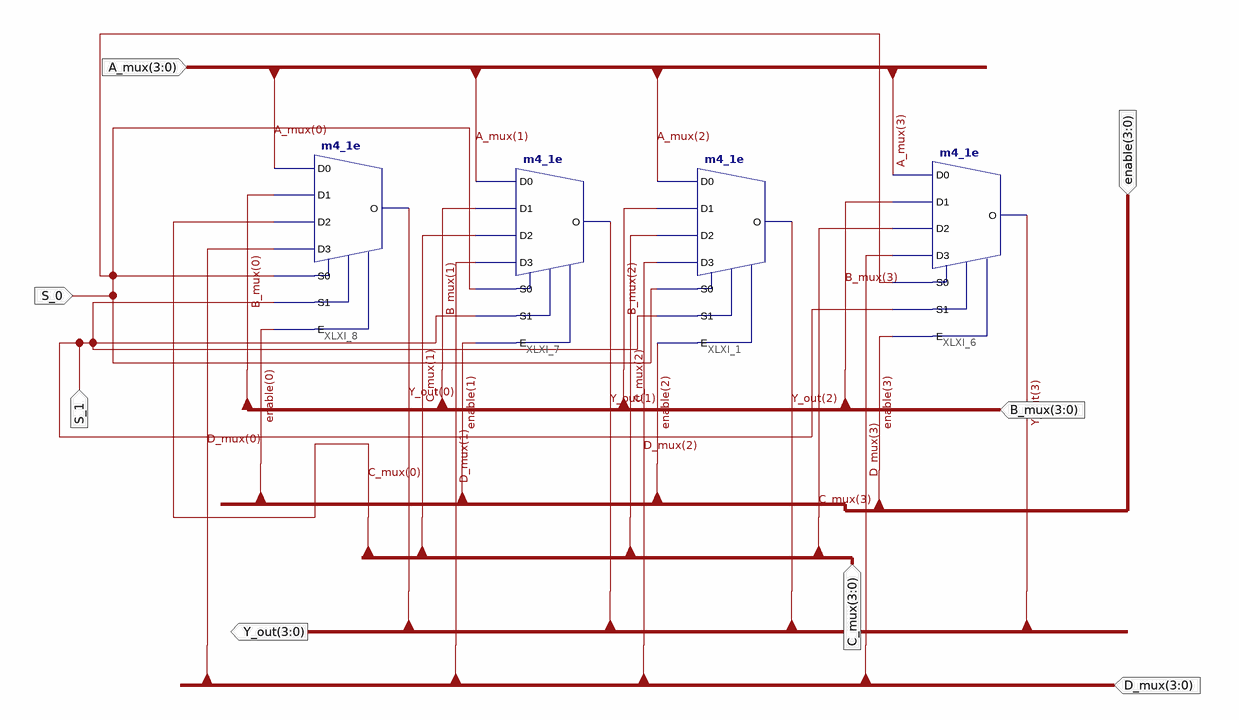
[diagram p0: schematic sheet 1]
// Xilinx ISE schematic mux4to4.sch (spartan6) as structural Verilog: 4 symbols, 8 ports
module mux4to4 (
  input  [3:0] A_mux,
  input  [3:0] B_mux,
  input  [3:0] C_mux,
  input  [3:0] D_mux,
  input  S_0,
  input  S_1,
  input  [3:0] enable,
  output [3:0] Y_out
);

  m4_1e XLXI_1 (
    .D0(A_mux[2]), .D1(B_mux[2]), .D2(C_mux[2]), .D3(D_mux[2]), .E(enable[2]), .S0(S_0), .S1(S_1),
    .O(Y_out[2]));
  m4_1e XLXI_6 (
    .D0(A_mux[3]), .D1(B_mux[3]), .D2(C_mux[3]), .D3(D_mux[3]), .E(enable[3]), .S0(S_0), .S1(S_1),
    .O(Y_out[3]));
  m4_1e XLXI_7 (
    .D0(A_mux[1]), .D1(B_mux[1]), .D2(C_mux[1]), .D3(D_mux[1]), .E(enable[1]), .S0(S_0), .S1(S_1),
    .O(Y_out[1]));
  m4_1e XLXI_8 (
    .D0(A_mux[0]), .D1(B_mux[0]), .D2(C_mux[0]), .D3(D_mux[0]), .E(enable[0]), .S0(S_0), .S1(S_1),
    .O(Y_out[0]));
endmodule
